# Altium schematic sheet charge.SchDoc
size 297 x 209 mm
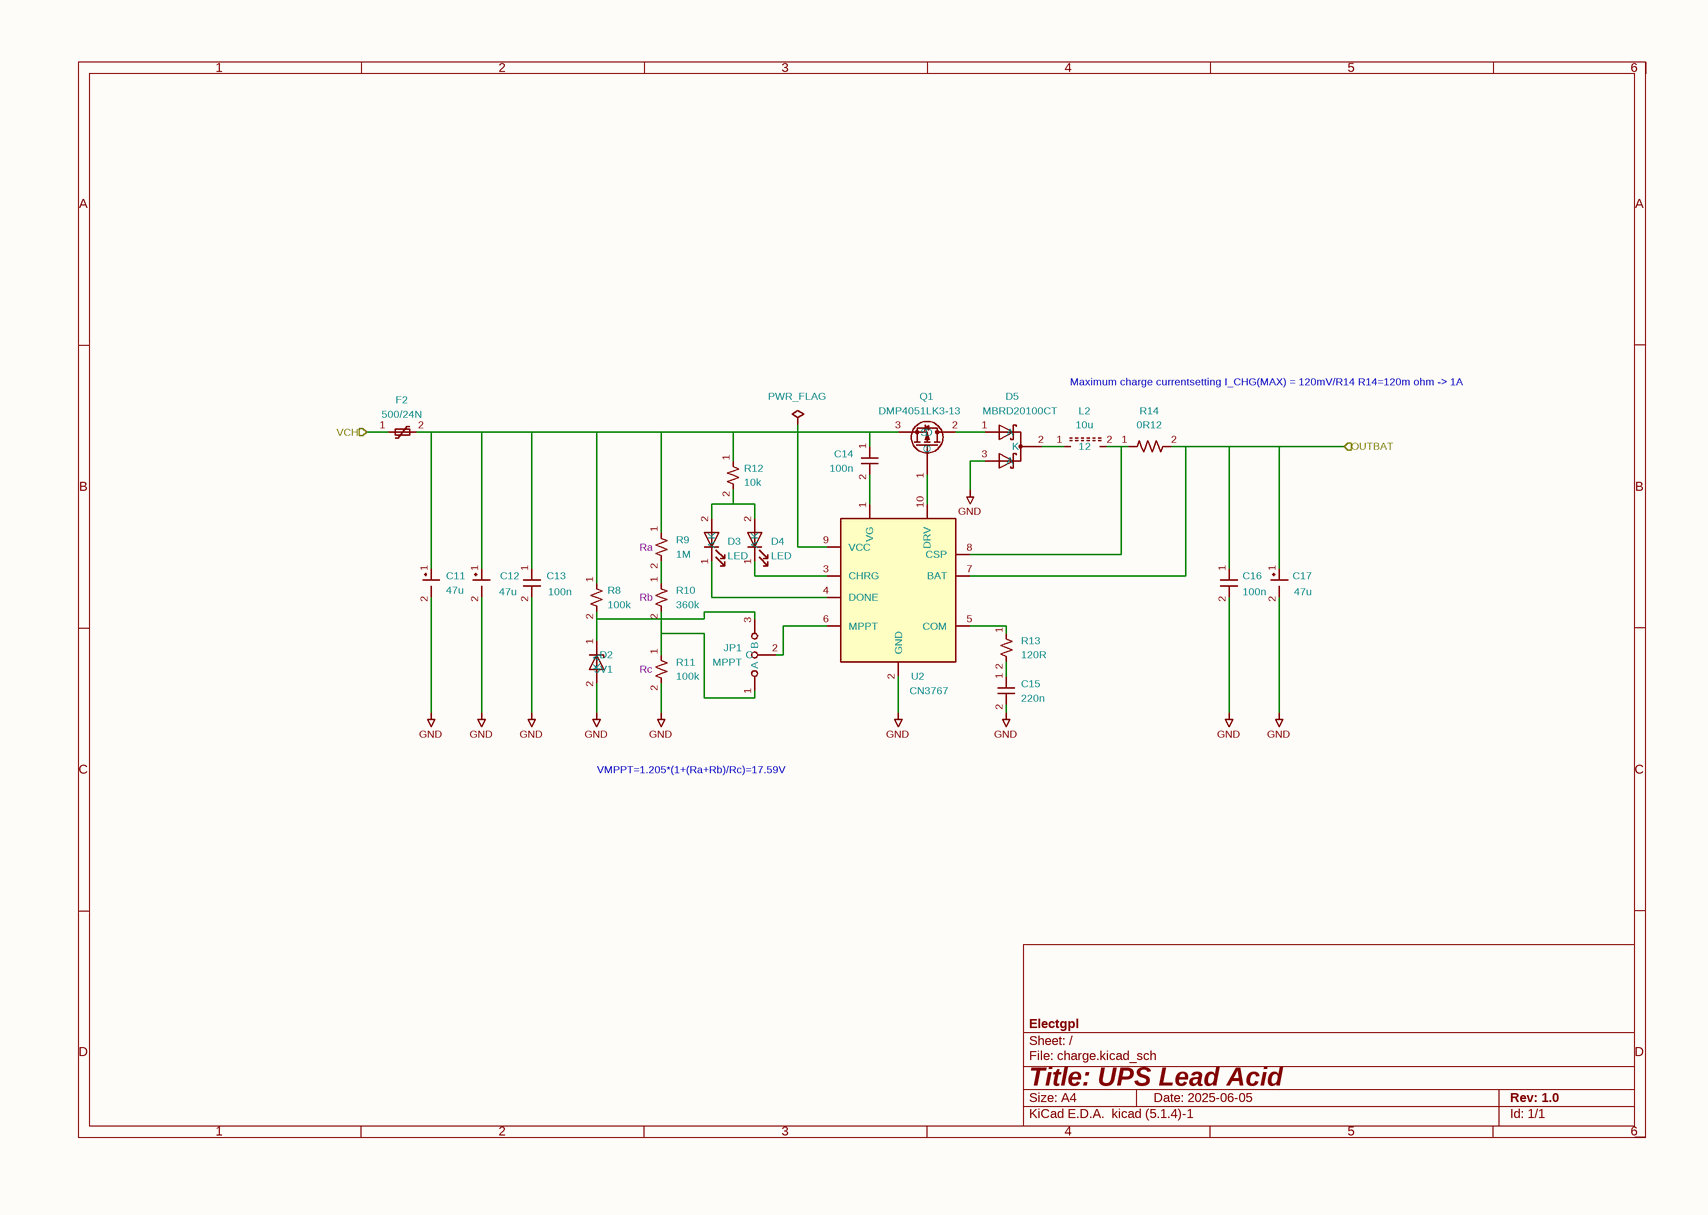
[diagram p0: charge.SchDoc]

## Parts
#FLG03  PWR_FLAG  (graphical)
C11  47u  [C_0805_2012Metric]
C12  47u  [C_0805_2012Metric]
C13  100n  [C_0603_1608Metric]
C14  100n  [C_0603_1608Metric]
C15  220n  [C_0603_1608Metric]
C16  100n  [C_0603_1608Metric]
C17  47u  [C_0805_2012Metric]
D2  5V1  [D_SOD-123]
D3  LED  [LED_0603_1608Metric]
D4  LED  [LED_0603_1608Metric]
D5  MBRD20100CT  [TO-252-2]
F2  500/24N  [Fuse_2920_7451Metric]
JP1  MPPT  [SolderJumper-3_P1.3mm_Open_Pad1.0x1.5mm]
L2  10u  [L_Taiyo-Yuden_NR-60xx]
Q1  DMP4051LK3-13  [TO-252-2]
R8  100k  [R_0603_1608Metric]
R9  Aux: Ra  [R_0603_1608Metric]  (hidden comment: 1M)
R10  Aux: Rb  [R_0603_1608Metric]  (hidden comment: 360k)
R11  Aux: Rc  [R_0603_1608Metric]  (hidden comment: 100k)
R12  10k  [R_0603_1608Metric]
R13  120R  [R_0603_1608Metric]
R14  0R12  [R_2512_6332Metric]
U2  CN3767  [SSOP-10_3.9x4.9mm_P1.00mm]

## Ports
OUTBAT (in), VCH (in)

## Nets
GND: C11.2 C12.2 C13.2 C15.2 C16.2 C17.2 D2.2(A) D5.3(A) R11.2 U2.2(GND)
OUTBAT: C16.1 C17.1 R14.2 U2.7(BAT) ; port OUTBAT
VCH: F2.1 ; port VCH
Net#FLG03_1: #FLG03.1 C11.1 C12.1 C13.1 C14.1 F2.2 Q1.3(S) R8.1 R9.1 R12.1 U2.9(VCC)
NetC14_2: C14.2 U2.1(VG)
NetC15_1: C15.1 R13.2
NetD2_1: D2.1(K) JP1.3(B) R8.2
NetD3_1: D3.1(K) U2.4(DONE)
NetD3_2: D3.2(A) D4.2(A) R12.2
NetD4_1: D4.1(K) U2.3(CHRG)
NetD5_1: D5.1(A) Q1.2(D)
NetD5_2: D5.2(K) L2.1
NetJP1_1: JP1.1(A) R10.2 R11.1
NetJP1_2: JP1.2(C) U2.6(MPPT)
NetL2_2: L2.2 R14.1 U2.8(CSP)
NetQ1_1: Q1.1(G) U2.10(DRV)
NetR9_2: R9.2 R10.1
NetR13_1: R13.1 U2.5(COM)

## Notes on the sheet
- Maximum charge currentsetting
  I_CHG(MAX) = 120mV/R14
  R14=120m ohm -> 1A
- VMPPT=1.205*(1+(Ra+Rb)/Rc)=17.59V
- 1
- 2
- 3
- 4
- 5
- 6
- A
- B
- C
- D
- Title: UPS Lead Acid
- File: charge.kicad_sch
- Sheet: /
- Electgpl
- KiCad E.D.A.  kicad (5.1.4)-1
- Size: A4
- Date: 2025-06-05
- Rev: 1.0
- Id: 1/1

## Library data of the parts
#FLG03 = PWR_FLAG: Description: Special symbol for telling ERC where power comes from; Value: PWR_FLAG
C11 C12 C17 = C_Polarized_Small_US: MFR P/N: CL21A226MAYNNNE; Internal P/N: C47U-25-5_5.4; LCSC: C602037; Value: 47u; Footprint: Capacitor_SMD:C_0805_2012Metric
C13 C14 C16 = C_Small: MFR P/N: CL10B104KB8NNNC; Internal P/N: C100N-50-0603; LCSC: C1591; Value: 100n; Footprint: Capacitor_SMD:C_0603_1608Metric
C15 = C_Small: MFR P/N: CL10B224KB8NNNC; Internal P/N: C220N-50-0603; LCSC: C64705; Value: 220n; Footprint: Capacitor_SMD:C_0603_1608Metric
D2 = D_Zener: MFR P/N: MMSZ5231BT1G; Internal P/N: DZ-5.1; LCSC: C66198; Value: 5V1; Footprint: Diode_SMD:D_SOD-123
D3 = LED: MFR P/N: XL-1608UYC-06; Internal P/N: DL-GREEN-0603; LCSC: C965802; Value: LED; Footprint: LED_SMD:LED_0603_1608Metric
D4 = LED: MFR P/N: XL-1608UYC-06; Internal P/N: DL-RED-0603; LCSC: C965802; Value: LED; Footprint: LED_SMD:LED_0603_1608Metric
D5 = D_Schottky_Dual_CommonCathode_AKA_Parallel: MFR P/N: MBRD20100CT-13; Description: 20A SCHOTTKY BARRIER RECTIFIER; LCSC: C460890; Value: MBRD20100CT; Footprint: Package_TO_SOT_SMD:TO-252-2
F2 = Polyfuse_Small: MFR P/N: SMD2920-500/24N; Description: 24V 5A 40A 10A 2920 Resettable Fuses ROHS; Absolute minimum: 16V 3A; Reference MFG P/N: C6165172; LCSC: C6165172; Value: 500/24N; Footprint: Fuse:Fuse_2920_7451Metric
JP1 = Jumper_3_Bridged12: Value: MPPT; Footprint: Jumper:SolderJumper-3_P1.3mm_Open_Pad1.0x1.5mm
L2 = L_Ferrite: MFR P/N: VLS6045EX-100M; Internal P/N: L10U-10-12_12_6; LCSC: C360734; Value: 10u; Footprint: Inductor_SMD:L_Taiyo-Yuden_NR-60xx
Q1 = QM6015D: Description: -35A Id, -60V Vds, P-Channel Power MOSFET, 25mOhm Ron, 25.0nC Qg (typ), TO252; LCSC: C397952; MFR P/N: DMP4051LK3-13; Value: DMP4051LK3-13; Footprint: Package_TO_SOT_SMD:TO-252-2
R8 R11 = R_Small_US: MFR P/N: FRC0603J104 TS; Internal P/N: R100K-0603-1; LCSC: C2907088; Value: 100k; Footprint: Resistor_SMD:R_0603_1608Metric
R9 = R_Small_US: MFR P/N: FRC0603F1004TS; Internal P/N: R1M-0603-1; LCSC: C2907003; Value: 1M; Footprint: Resistor_SMD:R_0603_1608Metric
R10 = R_Small_US: MFR P/N: FRC0603F3603TS; Internal P/N: R360K-0603-1; LCSC: C2907029; Value: 360k; Footprint: Resistor_SMD:R_0603_1608Metric
R12 = R_Small_US: MFR P/N: FRC0603J103 TS; Internal P/N: R10K-0603-1; LCSC: C2930027; Value: 10k; Footprint: Resistor_SMD:R_0603_1608Metric
R13 = R_Small_US: MFR P/N: FRC0603J121 TS; Internal P/N: R120-0603-1; LCSC: C2907096; Value: 120R; Footprint: Resistor_SMD:R_0603_1608Metric
R14 = R_US: MFR P/N: PT2512FK-7W0R12L; Internal P/N: R0.03-2512_2W-1; LCSC: C875871; Value: 0R12; Footprint: Resistor_SMD:R_2512_6332Metric
U2 = CN3767: MFR P/N: CN3767; LCSC: C81968; Value: CN3767; Footprint: Package_SO:SSOP-10_3.9x4.9mm_P1.00mm